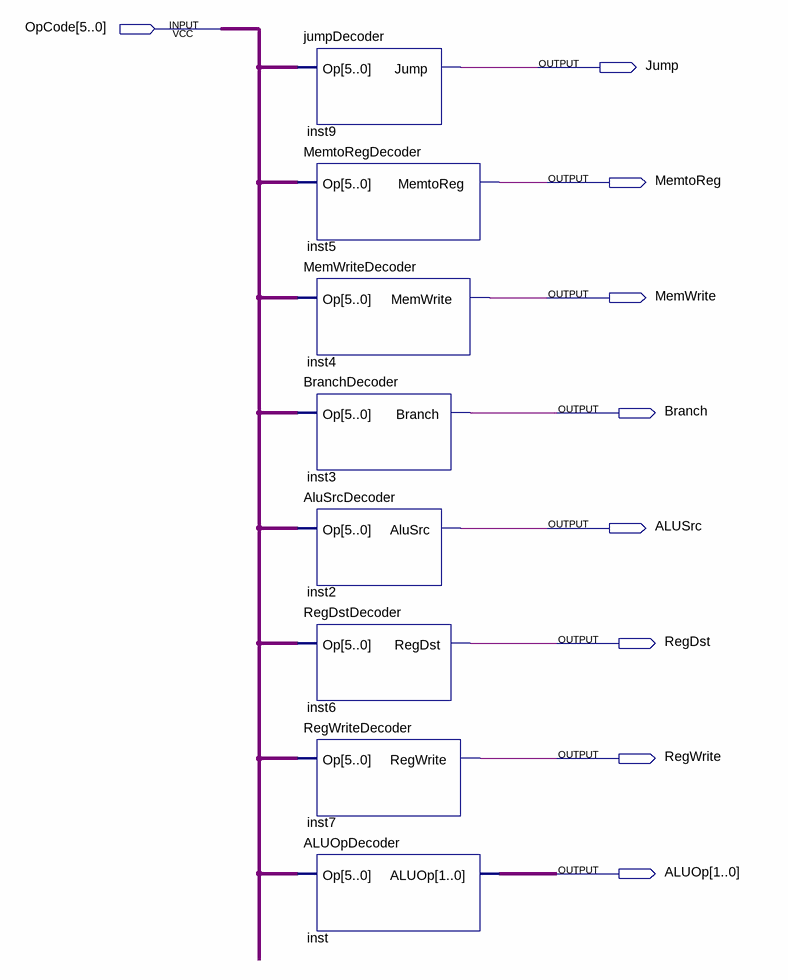
[diagram p0: schematic sheet]
// Quartus schematic mainDecoder.bdf as structural Verilog: 8 symbols, 9 pins
module mainDecoder (
  input  [5:0] OpCode,
  output Jump,
  output MemtoReg,
  output MemWrite,
  output Branch,
  output ALUSrc,
  output RegDst,
  output RegWrite,
  output [1:0] ALUOp
);

  jumpDecoder inst9 (.Op(OpCode), .Jump(Jump));
  MemtoRegDecoder inst5 (.Op(OpCode), .MemtoReg(MemtoReg));
  MemWriteDecoder inst4 (.Op(OpCode), .MemWrite(MemWrite));
  BranchDecoder inst3 (.Op(OpCode), .Branch(Branch));
  AluSrcDecoder inst2 (.Op(OpCode), .AluSrc(ALUSrc));
  RegDstDecoder inst6 (.Op(OpCode), .RegDst(RegDst));
  RegWriteDecoder inst7 (.Op(OpCode), .RegWrite(RegWrite));
  ALUOpDecoder inst (.Op(OpCode), .ALUOp(ALUOp));
endmodule
